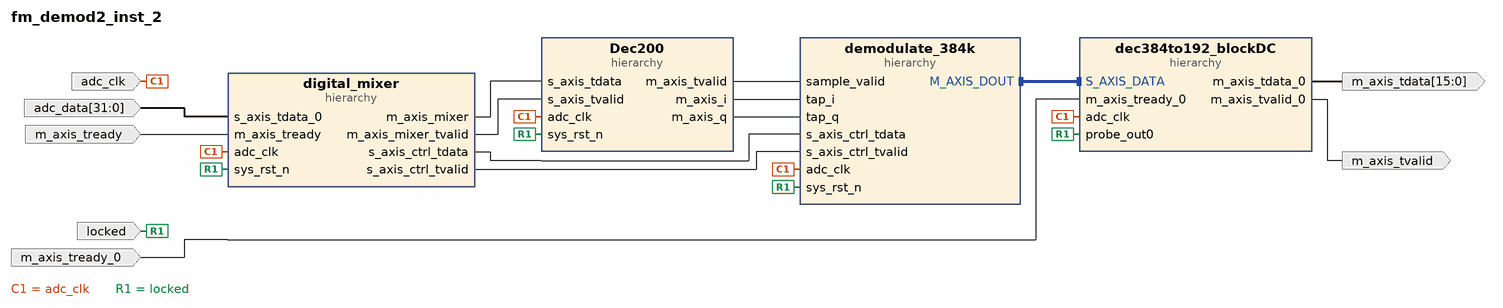
[diagram p0: block diagram of the top level]
# Vivado block design fm_demod2_inst_2, xc7z020clg400-2, Vivado 2023.2
create_bd_design fm_demod2_inst_2

create_bd_port -dir I adc_clk
create_bd_port -dir I -from 31 -to 0 adc_data
create_bd_port -dir I locked
create_bd_port -dir O -from 15 -to 0 m_axis_tdata
create_bd_port -dir I m_axis_tready
create_bd_port -dir I m_axis_tready_0
create_bd_port -dir O m_axis_tvalid

create_bd_cell -type hier Dec200
create_bd_cell -type hier dec384to192_blockDC
create_bd_cell -type hier demodulate_384k
create_bd_cell -type hier digital_mixer

# ---- hierarchy /Dec200 ----
current_bd_instance /Dec200
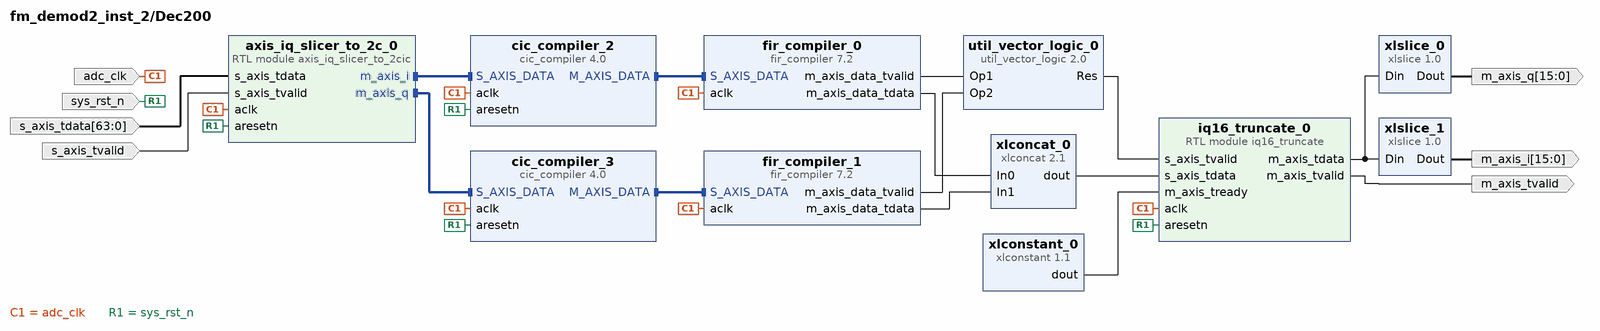
[diagram p1: block diagram inside /Dec200]
create_bd_pin -dir I adc_clk
create_bd_pin -dir I -type rst sys_rst_n
create_bd_pin -dir O -from 15 -to 0 m_axis_i
create_bd_pin -dir O -from 15 -to 0 m_axis_q
create_bd_pin -dir I -from 63 -to 0 s_axis_tdata
create_bd_pin -dir I s_axis_tvalid
create_bd_pin -dir O m_axis_tvalid

create_bd_cell -type ip -vlnv xilinx.com:ip:cic_compiler:4.0 cic_compiler_3
set_property -dict [list \
  CONFIG.Clock_Frequency 200.0 \
  CONFIG.Filter_Type Decimation \
  CONFIG.Fixed_Or_Initial_Rate 20 \
  CONFIG.HAS_ARESETN true \
  CONFIG.HAS_DOUT_TREADY true \
  CONFIG.Input_Data_Width 32 \
  CONFIG.Input_Sample_Frequency 0.001 \
  CONFIG.Maximum_Rate 20 \
  CONFIG.Minimum_Rate 20 \
  CONFIG.Number_Of_Stages 5 \
  CONFIG.Output_Data_Width 47 \
  CONFIG.Quantization Truncation \
  CONFIG.RateSpecification Sample_Period \
  CONFIG.SamplePeriod 1 \
  CONFIG.Use_Xtreme_DSP_Slice false \
] [get_bd_cells cic_compiler_3]
create_bd_cell -type module -reference axis_iq_slicer_to_2cic axis_iq_slicer_to_2c_0
set_property -dict {CONFIG.W 32} [get_bd_cells axis_iq_slicer_to_2c_0]
create_bd_cell -type ip -vlnv xilinx.com:ip:fir_compiler:7.2 fir_compiler_0
set_property -dict [list \
  CONFIG.CoefficientSource COE_File \
  CONFIG.CoefficientVector 6,0,-4,-3,5,6,-6,-13,7,44,64,44,7,-13,-6,6,5,-3,-4,0,6 \
  CONFIG.Coefficient_Fanout false \
  CONFIG.Coefficient_File ../../../../../../../../fir_384_140_190.coe \
  CONFIG.Coefficient_Fractional_Bits 0 \
  CONFIG.Coefficient_Sets 1 \
  CONFIG.Coefficient_Sign Signed \
  CONFIG.Coefficient_Structure Symmetric \
  CONFIG.Coefficient_Width 16 \
  CONFIG.ColumnConfig 1 \
  CONFIG.Control_Broadcast_Fanout false \
  CONFIG.Control_Column_Fanout false \
  CONFIG.Control_LUT_Pipeline false \
  CONFIG.Control_Path_Fanout false \
  CONFIG.Data_Path_Broadcast false \
  CONFIG.Data_Path_Fanout false \
  CONFIG.Decimation_Rate 10 \
  CONFIG.Disable_Half_Band_Centre_Tap false \
  CONFIG.Filter_Architecture Systolic_Multiply_Accumulate \
  CONFIG.Filter_Type Decimation \
  CONFIG.Interpolation_Rate 1 \
  CONFIG.No_BRAM_Read_First_Mode false \
  CONFIG.No_SRL_Attributes false \
  CONFIG.Number_Channels 1 \
  CONFIG.Optimal_Column_Lengths false \
  CONFIG.Optimization_Goal Area \
  CONFIG.Optimization_List None \
  CONFIG.Optimization_Selection None \
  CONFIG.Other false \
  CONFIG.Output_Rounding_Mode Convergent_Rounding_to_Even \
  CONFIG.Output_Width 32 \
  CONFIG.Pre_Adder_Pipeline false \
  CONFIG.Quantization Integer_Coefficients \
  CONFIG.RateSpecification Input_Sample_Period \
  CONFIG.SamplePeriod 20 \
  CONFIG.Zero_Pack_Factor 1 \
] [get_bd_cells fir_compiler_0]
create_bd_cell -type ip -vlnv xilinx.com:ip:fir_compiler:7.2 fir_compiler_1
set_property -dict [list \
  CONFIG.CoefficientSource COE_File \
  CONFIG.CoefficientVector 6,0,-4,-3,5,6,-6,-13,7,44,64,44,7,-13,-6,6,5,-3,-4,0,6 \
  CONFIG.Coefficient_Fanout false \
  CONFIG.Coefficient_File ../../../../../../../../fir_384_140_190.coe \
  CONFIG.Coefficient_Fractional_Bits 0 \
  CONFIG.Coefficient_Sets 1 \
  CONFIG.Coefficient_Sign Signed \
  CONFIG.Coefficient_Structure Symmetric \
  CONFIG.Coefficient_Width 16 \
  CONFIG.ColumnConfig 1 \
  CONFIG.Control_Broadcast_Fanout false \
  CONFIG.Control_Column_Fanout false \
  CONFIG.Control_LUT_Pipeline false \
  CONFIG.Control_Path_Fanout false \
  CONFIG.Data_Path_Broadcast false \
  CONFIG.Data_Path_Fanout false \
  CONFIG.Decimation_Rate 10 \
  CONFIG.Disable_Half_Band_Centre_Tap false \
  CONFIG.Filter_Architecture Systolic_Multiply_Accumulate \
  CONFIG.Filter_Type Decimation \
  CONFIG.Interpolation_Rate 1 \
  CONFIG.No_BRAM_Read_First_Mode false \
  CONFIG.No_SRL_Attributes false \
  CONFIG.Number_Channels 1 \
  CONFIG.Optimal_Column_Lengths false \
  CONFIG.Optimization_Goal Area \
  CONFIG.Optimization_List None \
  CONFIG.Optimization_Selection None \
  CONFIG.Other false \
  CONFIG.Output_Rounding_Mode Convergent_Rounding_to_Even \
  CONFIG.Output_Width 32 \
  CONFIG.Pre_Adder_Pipeline false \
  CONFIG.Quantization Integer_Coefficients \
  CONFIG.RateSpecification Input_Sample_Period \
  CONFIG.SamplePeriod 20 \
  CONFIG.Zero_Pack_Factor 1 \
] [get_bd_cells fir_compiler_1]
create_bd_cell -type ip -vlnv xilinx.com:ip:cic_compiler:4.0 cic_compiler_2
set_property -dict [list \
  CONFIG.Clock_Frequency 200.0 \
  CONFIG.Filter_Type Decimation \
  CONFIG.Fixed_Or_Initial_Rate 20 \
  CONFIG.HAS_ARESETN true \
  CONFIG.HAS_DOUT_TREADY true \
  CONFIG.Input_Data_Width 32 \
  CONFIG.Input_Sample_Frequency 0.001 \
  CONFIG.Maximum_Rate 20 \
  CONFIG.Minimum_Rate 20 \
  CONFIG.Number_Of_Stages 5 \
  CONFIG.Output_Data_Width 47 \
  CONFIG.Quantization Truncation \
  CONFIG.RateSpecification Sample_Period \
  CONFIG.SamplePeriod 1 \
  CONFIG.Use_Xtreme_DSP_Slice false \
] [get_bd_cells cic_compiler_2]
create_bd_cell -type ip -vlnv xilinx.com:ip:util_vector_logic:2.0 util_vector_logic_0
set_property -dict {CONFIG.C_SIZE 1} [get_bd_cells util_vector_logic_0]
create_bd_cell -type module -reference iq16_truncate iq16_truncate_0
set_property -dict {CONFIG.SHIFT 1} [get_bd_cells iq16_truncate_0]
create_bd_cell -type ip -vlnv xilinx.com:ip:xlslice:1.0 xlslice_0
set_property -dict {CONFIG.DIN_FROM 31 CONFIG.DIN_TO 16} [get_bd_cells xlslice_0]
create_bd_cell -type ip -vlnv xilinx.com:ip:xlslice:1.0 xlslice_1
set_property -dict {CONFIG.DIN_FROM 15} [get_bd_cells xlslice_1]
create_bd_cell -type ip -vlnv xilinx.com:ip:xlconcat:2.1 xlconcat_0
set_property -dict {CONFIG.IN0_WIDTH 32 CONFIG.IN1_WIDTH 32} [get_bd_cells xlconcat_0]
create_bd_cell -type ip -vlnv xilinx.com:ip:xlconstant:1.1 xlconstant_0

# ---- hierarchy /dec384to192_blockDC ----
current_bd_instance /dec384to192_blockDC
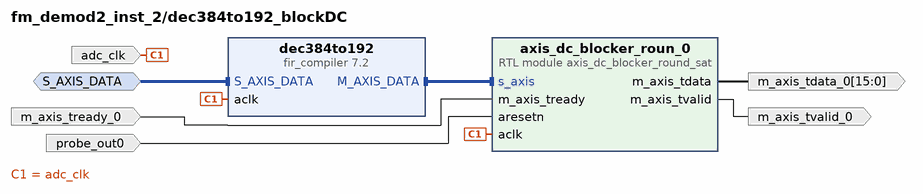
[diagram p2: block diagram inside /dec384to192_blockDC]
create_bd_intf_pin -mode Slave -vlnv xilinx.com:interface:axis_rtl:1.0 S_AXIS_DATA
create_bd_pin -dir I adc_clk
create_bd_pin -dir I probe_out0
create_bd_pin -dir O m_axis_tvalid_0
create_bd_pin -dir I m_axis_tready_0
create_bd_pin -dir O -from 15 -to 0 m_axis_tdata_0

create_bd_cell -type ip -vlnv xilinx.com:ip:fir_compiler:7.2 dec384to192
set_property -dict [list \
  CONFIG.Clock_Frequency 76.8 \
  CONFIG.CoefficientSource COE_File \
  CONFIG.Coefficient_Buffer_Type Automatic \
  CONFIG.Coefficient_Fanout false \
  CONFIG.Coefficient_File ../../../../../../../../fir_decim2_hex.coe \
  CONFIG.Coefficient_Fractional_Bits 0 \
  CONFIG.Coefficient_Sets 1 \
  CONFIG.Coefficient_Sign Signed \
  CONFIG.Coefficient_Structure Inferred \
  CONFIG.Coefficient_Width 16 \
  CONFIG.Control_Broadcast_Fanout false \
  CONFIG.Control_Column_Fanout false \
  CONFIG.Control_LUT_Pipeline false \
  CONFIG.Control_Path_Fanout false \
  CONFIG.Data_Buffer_Type Automatic \
  CONFIG.Data_Path_Broadcast false \
  CONFIG.Data_Path_Fanout false \
  CONFIG.Decimation_Rate 2 \
  CONFIG.Disable_Half_Band_Centre_Tap false \
  CONFIG.Filter_Architecture Systolic_Multiply_Accumulate \
  CONFIG.Filter_Type Decimation \
  CONFIG.Interpolation_Rate 1 \
  CONFIG.M_DATA_Has_TREADY true \
  CONFIG.No_BRAM_Read_First_Mode false \
  CONFIG.No_SRL_Attributes false \
  CONFIG.Number_Channels 1 \
  CONFIG.Optimal_Column_Lengths false \
  CONFIG.Optimization_Goal Area \
  CONFIG.Optimization_List None \
  CONFIG.Optimization_Selection None \
  CONFIG.Other false \
  CONFIG.Output_Rounding_Mode Convergent_Rounding_to_Even \
  CONFIG.Output_Width 24 \
  CONFIG.Pre_Adder_Pipeline false \
  CONFIG.Preference_For_Other_Storage Automatic \
  CONFIG.Quantization Integer_Coefficients \
  CONFIG.RateSpecification Frequency_Specification \
  CONFIG.Sample_Frequency 0.384 \
  CONFIG.Zero_Pack_Factor 1 \
] [get_bd_cells dec384to192]
create_bd_cell -type module -reference axis_dc_blocker_round_sat axis_dc_blocker_roun_0
set_property -dict {CONFIG.IN_W 24 CONFIG.SHIFT_R 6} [get_bd_cells axis_dc_blocker_roun_0]

# ---- hierarchy /demodulate_384k ----
current_bd_instance /demodulate_384k
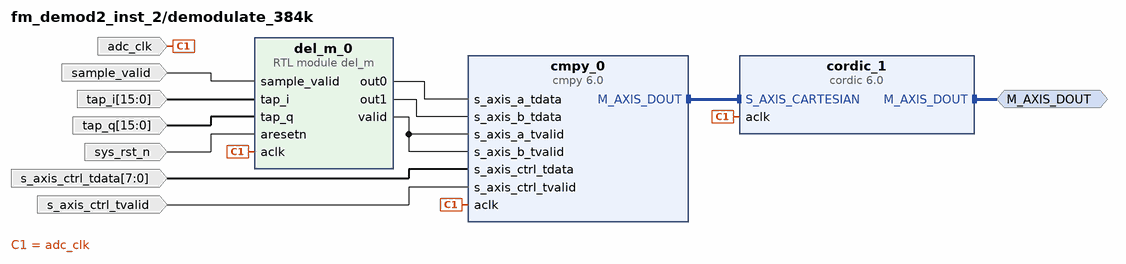
[diagram p3: block diagram inside /demodulate_384k]
create_bd_intf_pin -mode Master -vlnv xilinx.com:interface:axis_rtl:1.0 M_AXIS_DOUT
create_bd_pin -dir I adc_clk
create_bd_pin -dir I s_axis_ctrl_tvalid
create_bd_pin -dir I -from 7 -to 0 s_axis_ctrl_tdata
create_bd_pin -dir I -type rst sys_rst_n
create_bd_pin -dir I sample_valid
create_bd_pin -dir I -from 15 -to 0 tap_i
create_bd_pin -dir I -from 15 -to 0 tap_q

create_bd_cell -type ip -vlnv xilinx.com:ip:cmpy:6.0 cmpy_0
set_property -dict [list \
  CONFIG.APortWidth 16 \
  CONFIG.BPortWidth 16 \
  CONFIG.MinimumLatency 6 \
  CONFIG.OptimizeGoal Resources \
  CONFIG.OutputWidth 32 \
  CONFIG.RoundMode Random_Rounding \
] [get_bd_cells cmpy_0]
create_bd_cell -type module -reference del_m del_m_0
create_bd_cell -type ip -vlnv xilinx.com:ip:cordic:6.0 cordic_1
set_property -dict [list \
  CONFIG.Coarse_Rotation true \
  CONFIG.Data_Format SignedFraction \
  CONFIG.Functional_Selection Arc_Tan \
  CONFIG.Input_Width 32 \
  CONFIG.Output_Width 25 \
  CONFIG.Phase_Format Radians \
  CONFIG.Pipelining_Mode Optimal \
  CONFIG.Round_Mode Nearest_Even \
  CONFIG.flow_control Blocking \
  CONFIG.optimize_goal Performance \
  CONFIG.out_tready true \
] [get_bd_cells cordic_1]

# ---- hierarchy /digital_mixer ----
current_bd_instance /digital_mixer
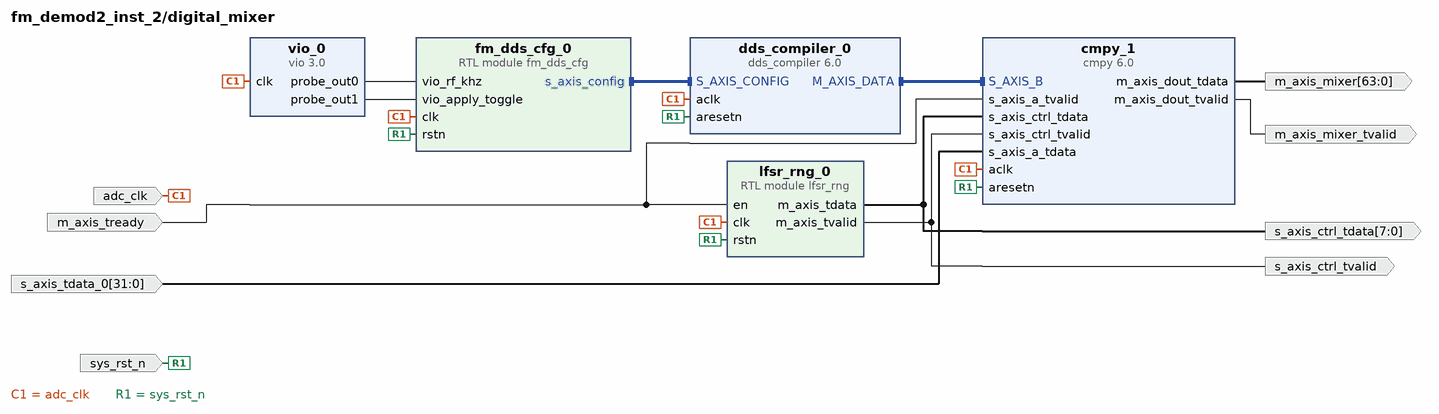
[diagram p4: block diagram inside /digital_mixer]
create_bd_pin -dir I adc_clk
create_bd_pin -dir I -type rst sys_rst_n
create_bd_pin -dir I m_axis_tready
create_bd_pin -dir O -from 7 -to 0 s_axis_ctrl_tdata
create_bd_pin -dir O s_axis_ctrl_tvalid
create_bd_pin -dir I -from 31 -to 0 s_axis_tdata_0
create_bd_pin -dir O -from 63 -to 0 m_axis_mixer
create_bd_pin -dir O m_axis_mixer_tvalid

create_bd_cell -type module -reference lfsr_rng lfsr_rng_0
create_bd_cell -type ip -vlnv xilinx.com:ip:cmpy:6.0 cmpy_1
set_property -dict [list \
  CONFIG.APortWidth 16 \
  CONFIG.ARESETN true \
  CONFIG.BPortWidth 16 \
  CONFIG.MinimumLatency 6 \
  CONFIG.MultType Use_Mults \
  CONFIG.OptimizeGoal Resources \
  CONFIG.OutputWidth 32 \
  CONFIG.RoundMode Random_Rounding \
] [get_bd_cells cmpy_1]
create_bd_cell -type ip -vlnv xilinx.com:ip:dds_compiler:6.0 dds_compiler_0
set_property -dict [list \
  CONFIG.DATA_Has_TLAST Not_Required \
  CONFIG.DDS_Clock_Rate 76.8 \
  CONFIG.Frequency_Resolution 0.4 \
  CONFIG.Has_ARESETn true \
  CONFIG.Has_Phase_Out false \
  CONFIG.Latency 8 \
  CONFIG.M_DATA_Has_TUSER Not_Required \
  CONFIG.Memory_Type Block_ROM \
  CONFIG.Negative_Sine true \
  CONFIG.Noise_Shaping Phase_Dithering \
  CONFIG.Optimization_Goal Auto \
  CONFIG.Output_Frequency1 0 \
  CONFIG.Output_Width 16 \
  CONFIG.PINC1 000110101010101010101 \
  CONFIG.Parameter_Entry Hardware_Parameters \
  CONFIG.Phase_Increment Programmable \
  CONFIG.Phase_Width 26 \
  CONFIG.S_PHASE_Has_TUSER Not_Required \
] [get_bd_cells dds_compiler_0]
create_bd_cell -type module -reference fm_dds_cfg fm_dds_cfg_0
set_property -dict {CONFIG.DEFAULT_RF_KHZ 26620} [get_bd_cells fm_dds_cfg_0]
create_bd_cell -type ip -vlnv xilinx.com:ip:vio:3.0 vio_0
set_property -dict [list \
  CONFIG.C_NUM_PROBE_IN 0 \
  CONFIG.C_NUM_PROBE_OUT 2 \
  CONFIG.C_PROBE_OUT0_INIT_VAL 0x155CC \
  CONFIG.C_PROBE_OUT0_WIDTH 17 \
  CONFIG.C_PROBE_OUT1_INIT_VAL 0x1 \
] [get_bd_cells vio_0]

# ---- connections ----

current_bd_instance /Dec200
connect_bd_intf_net [get_bd_intf_pins axis_iq_slicer_to_2c_0/m_axis_i] [get_bd_intf_pins cic_compiler_2/S_AXIS_DATA]
connect_bd_intf_net [get_bd_intf_pins axis_iq_slicer_to_2c_0/m_axis_q] [get_bd_intf_pins cic_compiler_3/S_AXIS_DATA]
connect_bd_intf_net [get_bd_intf_pins fir_compiler_0/S_AXIS_DATA] [get_bd_intf_pins cic_compiler_2/M_AXIS_DATA]
connect_bd_intf_net [get_bd_intf_pins cic_compiler_3/M_AXIS_DATA] [get_bd_intf_pins fir_compiler_1/S_AXIS_DATA]
connect_bd_net -net adc_dci_0_1 [get_bd_pins adc_clk] \
  [get_bd_pins axis_iq_slicer_to_2c_0/aclk] [get_bd_pins cic_compiler_3/aclk] [get_bd_pins fir_compiler_0/aclk] \
  [get_bd_pins fir_compiler_1/aclk] [get_bd_pins cic_compiler_2/aclk] [get_bd_pins iq16_truncate_0/aclk]
connect_bd_net -net cmpy_1_m_axis_dout_tdata [get_bd_pins s_axis_tdata] [get_bd_pins axis_iq_slicer_to_2c_0/s_axis_tdata]
connect_bd_net -net cmpy_1_m_axis_dout_tvalid [get_bd_pins s_axis_tvalid] [get_bd_pins axis_iq_slicer_to_2c_0/s_axis_tvalid]
connect_bd_net [get_bd_pins fir_compiler_0/m_axis_data_tdata] [get_bd_pins xlconcat_0/In0]
connect_bd_net [get_bd_pins fir_compiler_0/m_axis_data_tvalid] [get_bd_pins util_vector_logic_0/Op1]
connect_bd_net [get_bd_pins fir_compiler_1/m_axis_data_tdata] [get_bd_pins xlconcat_0/In1]
connect_bd_net [get_bd_pins fir_compiler_1/m_axis_data_tvalid] [get_bd_pins util_vector_logic_0/Op2]
connect_bd_net [get_bd_pins iq16_truncate_0/m_axis_tdata] [get_bd_pins xlslice_0/Din] [get_bd_pins xlslice_1/Din]
connect_bd_net [get_bd_pins iq16_truncate_0/m_axis_tvalid] [get_bd_pins m_axis_tvalid]
connect_bd_net -net sys_rst_n_0_1 [get_bd_pins sys_rst_n] \
  [get_bd_pins axis_iq_slicer_to_2c_0/aresetn] [get_bd_pins cic_compiler_3/aresetn] [get_bd_pins cic_compiler_2/aresetn] \
  [get_bd_pins iq16_truncate_0/aresetn]
connect_bd_net [get_bd_pins util_vector_logic_0/Res] [get_bd_pins iq16_truncate_0/s_axis_tvalid]
connect_bd_net [get_bd_pins xlconcat_0/dout] [get_bd_pins iq16_truncate_0/s_axis_tdata]
connect_bd_net [get_bd_pins xlconstant_0/dout] [get_bd_pins iq16_truncate_0/m_axis_tready]
connect_bd_net [get_bd_pins xlslice_0/Dout] [get_bd_pins m_axis_q]
connect_bd_net [get_bd_pins xlslice_1/Dout] [get_bd_pins m_axis_i]

current_bd_instance /dec384to192_blockDC
connect_bd_intf_net [get_bd_intf_pins dec384to192/M_AXIS_DATA] [get_bd_intf_pins axis_dc_blocker_roun_0/s_axis]
connect_bd_intf_net -intf_net demodulate_384k_M_AXIS_DOUT [get_bd_intf_pins S_AXIS_DATA] [get_bd_intf_pins dec384to192/S_AXIS_DATA]
connect_bd_net [get_bd_pins adc_clk] [get_bd_pins dec384to192/aclk] [get_bd_pins axis_dc_blocker_roun_0/aclk]
connect_bd_net [get_bd_pins axis_dc_blocker_roun_0/m_axis_tdata] [get_bd_pins m_axis_tdata_0]
connect_bd_net [get_bd_pins axis_dc_blocker_roun_0/m_axis_tvalid] [get_bd_pins m_axis_tvalid_0]
connect_bd_net -net m_axis_tready_0_1 [get_bd_pins m_axis_tready_0] [get_bd_pins axis_dc_blocker_roun_0/m_axis_tready]
connect_bd_net -net vio_0_probe_out0 [get_bd_pins probe_out0] [get_bd_pins axis_dc_blocker_roun_0/aresetn]

current_bd_instance /demodulate_384k
connect_bd_intf_net [get_bd_intf_pins cordic_1/M_AXIS_DOUT] [get_bd_intf_pins M_AXIS_DOUT]
connect_bd_intf_net [get_bd_intf_pins cmpy_0/M_AXIS_DOUT] [get_bd_intf_pins cordic_1/S_AXIS_CARTESIAN]
connect_bd_net -net Dec200_Res_0 [get_bd_pins sample_valid] [get_bd_pins del_m_0/sample_valid]
connect_bd_net -net adc_dci_0_1 [get_bd_pins adc_clk] [get_bd_pins del_m_0/aclk] [get_bd_pins cordic_1/aclk] [get_bd_pins cmpy_0/aclk]
connect_bd_net -net cic_compiler_2_m_axis_data_tdata [get_bd_pins tap_i] [get_bd_pins del_m_0/tap_i]
connect_bd_net -net cic_compiler_3_m_axis_data_tdata [get_bd_pins tap_q] [get_bd_pins del_m_0/tap_q]
connect_bd_net [get_bd_pins del_m_0/out0] [get_bd_pins cmpy_0/s_axis_a_tdata]
connect_bd_net [get_bd_pins del_m_0/out1] [get_bd_pins cmpy_0/s_axis_b_tdata]
connect_bd_net [get_bd_pins del_m_0/valid] [get_bd_pins cmpy_0/s_axis_a_tvalid] [get_bd_pins cmpy_0/s_axis_b_tvalid]
connect_bd_net -net lfsr_rng_0_m_axis_tdata [get_bd_pins s_axis_ctrl_tdata] [get_bd_pins cmpy_0/s_axis_ctrl_tdata]
connect_bd_net -net lfsr_rng_0_m_axis_tvalid [get_bd_pins s_axis_ctrl_tvalid] [get_bd_pins cmpy_0/s_axis_ctrl_tvalid]
connect_bd_net -net sys_rst_n_0_1 [get_bd_pins sys_rst_n] [get_bd_pins del_m_0/aresetn]

current_bd_instance /digital_mixer
connect_bd_intf_net [get_bd_intf_pins dds_compiler_0/M_AXIS_DATA] [get_bd_intf_pins cmpy_1/S_AXIS_B]
connect_bd_intf_net [get_bd_intf_pins fm_dds_cfg_0/s_axis_config] [get_bd_intf_pins dds_compiler_0/S_AXIS_CONFIG]
connect_bd_net -net adc_dci_0_1 [get_bd_pins adc_clk] \
  [get_bd_pins dds_compiler_0/aclk] [get_bd_pins cmpy_1/aclk] [get_bd_pins lfsr_rng_0/clk] [get_bd_pins vio_0/clk] \
  [get_bd_pins fm_dds_cfg_0/clk]
connect_bd_net [get_bd_pins cmpy_1/m_axis_dout_tdata] [get_bd_pins m_axis_mixer]
connect_bd_net [get_bd_pins cmpy_1/m_axis_dout_tvalid] [get_bd_pins m_axis_mixer_tvalid]
connect_bd_net [get_bd_pins lfsr_rng_0/m_axis_tdata] [get_bd_pins s_axis_ctrl_tdata] [get_bd_pins cmpy_1/s_axis_ctrl_tdata]
connect_bd_net [get_bd_pins lfsr_rng_0/m_axis_tvalid] [get_bd_pins s_axis_ctrl_tvalid] [get_bd_pins cmpy_1/s_axis_ctrl_tvalid]
connect_bd_net -net s_axis_tdata_0_1 [get_bd_pins s_axis_tdata_0] [get_bd_pins cmpy_1/s_axis_a_tdata]
connect_bd_net -net sys_rst_n_0_1 [get_bd_pins sys_rst_n] \
  [get_bd_pins lfsr_rng_0/rstn] [get_bd_pins cmpy_1/aresetn] [get_bd_pins dds_compiler_0/aresetn] \
  [get_bd_pins fm_dds_cfg_0/rstn]
connect_bd_net [get_bd_pins vio_0/probe_out0] [get_bd_pins fm_dds_cfg_0/vio_rf_khz]
connect_bd_net [get_bd_pins vio_0/probe_out1] [get_bd_pins fm_dds_cfg_0/vio_apply_toggle]
connect_bd_net -net xlconstant_0_dout [get_bd_pins m_axis_tready] [get_bd_pins cmpy_1/s_axis_a_tvalid] [get_bd_pins lfsr_rng_0/en]

current_bd_instance /
connect_bd_intf_net [get_bd_intf_pins dec384to192_blockDC/S_AXIS_DATA] [get_bd_intf_pins demodulate_384k/M_AXIS_DOUT]
connect_bd_net [get_bd_pins Dec200/m_axis_tvalid] [get_bd_pins demodulate_384k/sample_valid]
connect_bd_net -net LTC_2208_0_m_axis_tdata [get_bd_ports adc_data] [get_bd_pins digital_mixer/s_axis_tdata_0]
connect_bd_net [get_bd_ports adc_clk] \
  [get_bd_pins digital_mixer/adc_clk] [get_bd_pins demodulate_384k/adc_clk] [get_bd_pins Dec200/adc_clk] \
  [get_bd_pins dec384to192_blockDC/adc_clk]
connect_bd_net -net axis_dc_blocker_roun_0_m_axis_tdata [get_bd_pins dec384to192_blockDC/m_axis_tdata_0] [get_bd_ports m_axis_tdata]
connect_bd_net -net axis_dc_blocker_roun_0_m_axis_tvalid [get_bd_pins dec384to192_blockDC/m_axis_tvalid_0] [get_bd_ports m_axis_tvalid]
connect_bd_net -net cic_compiler_2_m_axis_data_tdata [get_bd_pins Dec200/m_axis_i] [get_bd_pins demodulate_384k/tap_i]
connect_bd_net -net cic_compiler_3_m_axis_data_tdata [get_bd_pins Dec200/m_axis_q] [get_bd_pins demodulate_384k/tap_q]
connect_bd_net -net digital_mixer_m_axis_dout_tdata_0 [get_bd_pins digital_mixer/m_axis_mixer] [get_bd_pins Dec200/s_axis_tdata]
connect_bd_net -net digital_mixer_m_axis_dout_tvalid_0 [get_bd_pins digital_mixer/m_axis_mixer_tvalid] [get_bd_pins Dec200/s_axis_tvalid]
connect_bd_net -net lfsr_rng_0_m_axis_tdata [get_bd_pins digital_mixer/s_axis_ctrl_tdata] [get_bd_pins demodulate_384k/s_axis_ctrl_tdata]
connect_bd_net -net lfsr_rng_0_m_axis_tvalid [get_bd_pins digital_mixer/s_axis_ctrl_tvalid] [get_bd_pins demodulate_384k/s_axis_ctrl_tvalid]
connect_bd_net -net m_axis_tready_0_1 [get_bd_ports m_axis_tready_0] [get_bd_pins dec384to192_blockDC/m_axis_tready_0]
connect_bd_net [get_bd_ports m_axis_tready] [get_bd_pins digital_mixer/m_axis_tready]
connect_bd_net -net vio_0_probe_out0 [get_bd_ports locked] \
  [get_bd_pins digital_mixer/sys_rst_n] [get_bd_pins demodulate_384k/sys_rst_n] [get_bd_pins Dec200/sys_rst_n] \
  [get_bd_pins dec384to192_blockDC/probe_out0]

validate_bd_design
save_bd_design
